# EAGLE design EmcoInterfaceBoard_v4 (EAGLE 8.0.2)
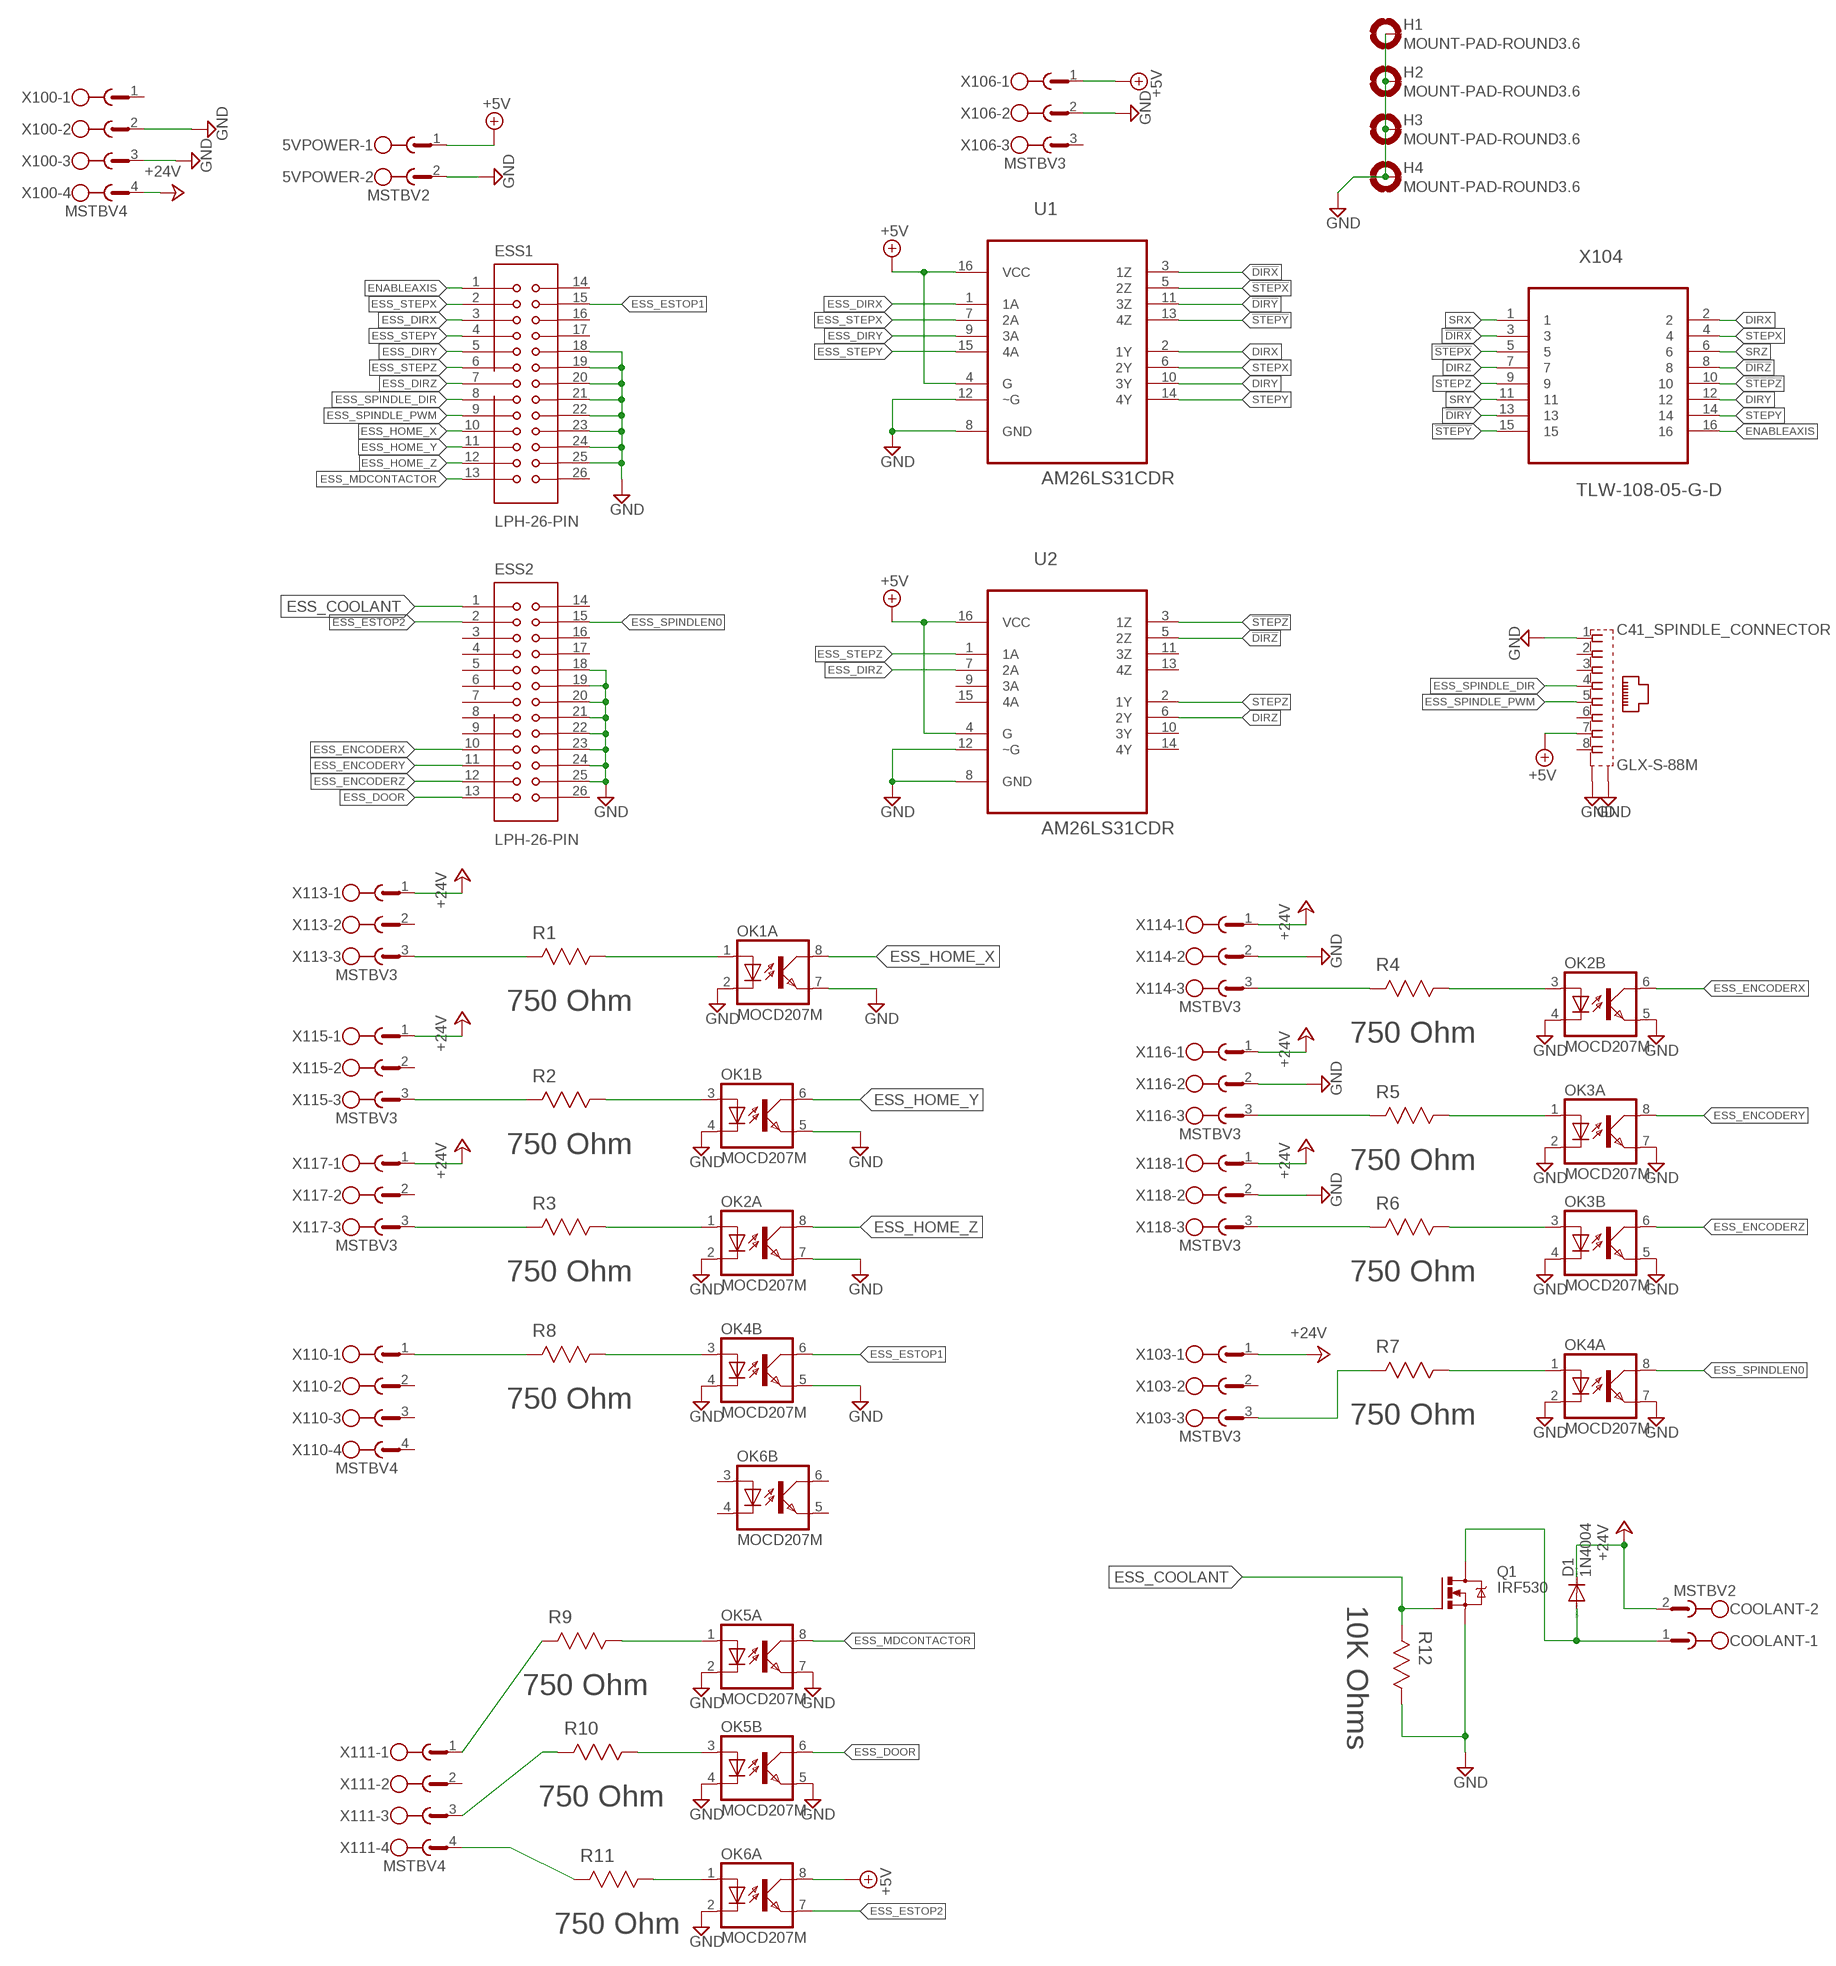
[diagram p0: schematic, sheet 1]

## Parts
5VPOWER  MSTBV2  [MSTBV2]
C41_SPINDLE_CONNECTOR  GLX-S-88M  [GLX-S-88M]
COOLANT  MSTBV2  [MSTBV2]
D1  1N4004  [DO41-10]
ESS1  LPH-26-PIN  [LOWPROFILEHEADER-26PIN]
ESS2  LPH-26-PIN  [LOWPROFILEHEADER-26PIN]
H1  MOUNT-PAD-ROUND3.6  [3,6-PAD]
H2  MOUNT-PAD-ROUND3.6  [3,6-PAD]
H3  MOUNT-PAD-ROUND3.6  [3,6-PAD]
H4  MOUNT-PAD-ROUND3.6  [3,6-PAD]
OK1  MOCD207M  [SOIC08-FAIRCHILD]
OK2  MOCD207M  [SOIC08-FAIRCHILD]
OK3  MOCD207M  [SOIC08-FAIRCHILD]
OK4  MOCD207M  [SOIC08-FAIRCHILD]
OK5  MOCD207M  [SOIC08-FAIRCHILD]
OK6  MOCD207M  [SOIC08-FAIRCHILD]
Q1  IRF530  [TO220BV]
R1  750 Ohm  CRCW2512750RFKEG  [RESC6332X71N]
R2  750 Ohm  CRCW2512750RFKEG  [RESC6332X71N]
R3  750 Ohm  CRCW2512750RFKEG  [RESC6332X71N]
R4  750 Ohm  CRCW2512750RFKEG  [RESC6332X71N]
R5  750 Ohm  CRCW2512750RFKEG  [RESC6332X71N]
R6  750 Ohm  CRCW2512750RFKEG  [RESC6332X71N]
R7  750 Ohm  CRCW2512750RFKEG  [RESC6332X71N]
R8  750 Ohm  CRCW2512750RFKEG  [RESC6332X71N]
R9  750 Ohm  CRCW2512750RFKEG  [RESC6332X71N]
R10  750 Ohm  CRCW2512750RFKEG  [RESC6332X71N]
R11  750 Ohm  CRCW2512750RFKEG  [RESC6332X71N]
R12  10K Ohms  MC0.125W12065%10K  [RESC3216X71N]
U1  AM26LS31CDR  [SOIC127P600X175-16N]
U2  AM26LS31CDR  [SOIC127P600X175-16N]
X100  MSTBV4  [MSTBV4]
X103  MSTBV3  [MSTBV3]
X104  TLW-108-05-G-D  [SAMTEC_TLW-108-05-G-D]
X106  MSTBV3  [MSTBV3]
X110  MSTBV4  [MSTBV4]
X111  MSTBV4  [MSTBV4]
X113  MSTBV3  [MSTBV3]
X114  MSTBV3  [MSTBV3]
X115  MSTBV3  [MSTBV3]
X116  MSTBV3  [MSTBV3]
X117  MSTBV3  [MSTBV3]
X118  MSTBV3  [MSTBV3]

## Nets
!DIRX! [5VSignal]: U1.3(1Z) X104.3
!DIRY! [5VSignal]: U1.11(3Z) X104.13
!DIRZ! [5VSignal]: U2.5(2Z) X104.8
!STEPX! [5VSignal]: U1.5(2Z) X104.5
!STEPY! [5VSignal]: U1.13(4Z) X104.15
!STEPZ! [5VSignal]: U2.3(1Z) X104.10
+5V [Power]: 5VPOWER.1 C41_SPINDLE_CONNECTOR.7 OK6.8(A:COL) U1.4(G) U1.16(VCC) U2.4(G) U2.16(VCC) X106.1
+24V [Power]: COOLANT.2 D1.C X100.4 X103.1 X113.1 X114.1 X115.1 X116.1 X117.1 X118.1
DIRX [5VSignal]: U1.2(1Y) X104.2
DIRY [5VSignal]: U1.10(3Y) X104.12
DIRZ [5VSignal]: U2.6(2Y) X104.7
ENABLEAXIS [5VSignal]: ESS1.1 X104.16
ENCODERX [24VSignal]: R4.2 X114.3
ENCODERY [24VSignal]: R5.2 X116.3
ENCODERZ [24VSignal]: R6.2 X118.3
ESS_COOLANT: ESS2.1 Q1.G R12.2(R2)
ESS_DIRX [5VSignal]: ESS1.3 U1.1(1A)
ESS_DIRY [5VSignal]: ESS1.5 U1.9(3A)
ESS_DIRZ [5VSignal]: ESS1.7 U2.7(2A)
ESS_DOOR: ESS2.13 OK5.6(B:COL)
ESS_ENCODERX: ESS2.10 OK2.6(B:COL)
ESS_ENCODERY: ESS2.11 OK3.8(A:COL)
ESS_ENCODERZ: ESS2.12 OK3.6(B:COL)
ESS_ESTOP1: ESS1.15 OK4.6(B:COL)
ESS_ESTOP2: ESS2.2 OK6.7(A:EMIT)
ESS_HOME_X: ESS1.10 OK1.8(A:COL)
ESS_HOME_Y: ESS1.11 OK1.6(B:COL)
ESS_HOME_Z: ESS1.12 OK2.8(A:COL)
ESS_MDCONTACTOR: ESS1.13 OK5.8(A:COL)
ESS_SPINDLE_DIR [5VSignal]: C41_SPINDLE_CONNECTOR.4 ESS1.8
ESS_SPINDLE_PWM [5VSignal]: C41_SPINDLE_CONNECTOR.5 ESS1.9
ESS_SPINDLEN0: ESS2.15 OK4.8(A:COL)
ESS_STEPX [5VSignal]: ESS1.2 U1.7(2A)
ESS_STEPY [5VSignal]: ESS1.4 U1.15(4A)
ESS_STEPZ [5VSignal]: ESS1.6 U2.1(1A)
GND [GND]: 5VPOWER.2 C41_SPINDLE_CONNECTOR.1 C41_SPINDLE_CONNECTOR.S1 C41_SPINDLE_CONNECTOR.S2 ESS1.18 ESS1.19 ESS1.20 ESS1.21 ESS1.22 ESS1.23 ESS1.24 ESS1.25 ESS2.18 ESS2.19 ESS2.20 ESS2.21 ESS2.22 ESS2.23 ESS2.24 ESS2.25 H1.B3,6(MOUNT) H2.B3,6(MOUNT) H3.B3,6(MOUNT) H4.B3,6(MOUNT) OK1.2(A:C) OK1.4(B:C) OK1.5(B:EMIT) OK1.7(A:EMIT) OK2.2(A:C) OK2.4(B:C) OK2.5(B:EMIT) OK2.7(A:EMIT) OK3.2(A:C) OK3.4(B:C) OK3.5(B:EMIT) OK3.7(A:EMIT) OK4.2(A:C) OK4.4(B:C) OK4.5(B:EMIT) OK4.7(A:EMIT) OK5.2(A:C) OK5.4(B:C) OK5.5(B:EMIT) OK5.7(A:EMIT) OK6.2(A:C) Q1.S R12.1(R1) U1.8(GND) U1.12(~G) U2.8(GND) U2.12(~G) X100.2 X100.3 X106.2 X114.2 X116.2 X118.2
N$1 [24VSignal]: OK3.3(B:A) R6.1
N$3 [24VSignal]: OK3.1(A:A) R5.1
N$7 [24VSignal]: OK2.3(B:A) R4.1
N$8: OK1.3(B:A) R2.1
N$9 [24VSignal]: OK2.1(A:A) R3.1
N$10 [24VSignal]: OK1.1(A:A) R1.1
N$11 [24VSignal]: OK4.1(A:A) R7.1
N$12 [24VSignal]: R1.2 X113.3
N$13 [24VSignal]: R7.2 X103.3
N$14: R2.2 X115.3
N$15 [24VSignal]: R8.2 X110.1
N$16 [24VSignal]: R3.2 X117.3
N$17 [24VSignal]: OK4.3(B:A) R8.1
N$18 [24VSignal]: R9.2 X111.1
N$19 [24VSignal]: OK5.1(A:A) R9.1
N$20 [24VSignal]: OK5.3(B:A) R10.1
N$21 [24VSignal]: R10.2 X111.3
N$22 [24VSignal]: OK6.1(A:A) R11.1
N$23 [24VSignal]: R11.2 X111.4
N$26: COOLANT.1 D1.A Q1.D
SRX: X104.1
SRY: X104.11
SRZ: X104.6
STEPX [5VSignal]: U1.6(2Y) X104.4
STEPY [5VSignal]: U1.14(4Y) X104.14
STEPZ [5VSignal]: U2.2(1Y) X104.9
Unconnected: C41_SPINDLE_CONNECTOR.2 C41_SPINDLE_CONNECTOR.3 C41_SPINDLE_CONNECTOR.6 C41_SPINDLE_CONNECTOR.8 ESS1.14 ESS1.16 ESS1.17 ESS1.26 ESS2.3 ESS2.4 ESS2.5 ESS2.6 ESS2.7 ESS2.8 ESS2.9 ESS2.14 ESS2.16 ESS2.17 ESS2.26 OK6.3(B:A) OK6.4(B:C) OK6.5(B:EMIT) OK6.6(B:COL) U2.9(3A) U2.10(3Y) U2.11(3Z) U2.13(4Z) U2.14(4Y) U2.15(4A) X100.1 X103.2 X106.3 X110.2 X110.3 X110.4 X111.2 X113.2 X115.2 X117.2

## Library data of the parts
5VPOWER COOLANT = con-phoenix-508:MSTBV2: PHOENIX; MF: WEIDMULLER, INC.; MPN: 1521860000; OC_FARNELL: 1792792; OC_NEWARK: 36K7716
C41_SPINDLE_CONNECTOR = con-kycon:GLX-S-88M: Mod. Jack, Right Angle, 8 posiotion, 8 contatcs RJ45 Source: GLX-S-88M.pdf; MF: MOLEX; MPN: 43860-0025; OC_FARNELL: unknown; OC_NEWARK: 57H0755
D1 = diode:1N4004: DIODE general purpose rectifier, 1 A; MPN: 1N4007.; OC_NEWARK: 98K5005
ESS1 ESS2 = ESS_Rev0:LPH-26-PIN; MF: TYCO ELECTRONICS; MPN: 5103308-6; OC_NEWARK: 73K6771
H1-H4 = ESS_Rev0:MOUNT-PAD-ROUND: MOUNTING PAD, round; OC_NEWARK: unknown
OK1-OK6 = optocoupler:MOCD20*M: MOCD207M, MOCD208M Dual Channel Phototransistor Small Outline Surface Mount Optocouplers Source: Data sheet <http://www.fairchildsemi.com/ds/MO%2FMOCD207-M.pdf>; MF: FAIRCHILD SEMICONDUCTOR; MPN: MOCD207M; OC_FARNELL: 1623297; OC_NEWARK: 67K0803
Q1 = transistor-power:IRF530: HEXFET Power MOSFET; MF: FAIRCHILD SEMICONDUCTOR; MPN: FQP30N06L; OC_NEWARK: 20C4477
R1-R11 = Vishay_By_element14_Batch_1:CRCW2512750RFKEG: RESISTOR, 2512; MF: VISHAY/DALE; MPN: CRCW2512750RFKEG; OC_FARNELL: 1703769; OC_NEWARK: 53K3986; SUPPLIER: Vishay; TOLERANCE: ±1%; WATTAGE: 1 W
R12 = Multicomp_By_element14_Batch_1:MC0.125W12065%10K: RESISTOR, 1206; MPN: RC1206FR-0710KL; OC_FARNELL: 9337016; OC_NEWARK: 68R0292; SUPPLIER: Multicomp; TOLERANCE: ±5%; WATTAGE: 1/8 W
U1 U2 = Texas Instruments_By_element14_Batch_1:AM26LS31CDR: QUADRUPLE DIFFERENTIAL LINE DRIVER; MF: TEXAS INSTRUMENTS; MPN: AM26LS31CDR; OC_FARNELL: -; OC_NEWARK: 34K0704; PACKAGE: SOIC-16; SUPPLIER: TEXAS INSTRUMENTS
X100 X110 X111 = con-phoenix-508:MSTBV4: PHOENIX; MF: WEIDMULLER, INC.; MPN: 1522060000; OC_FARNELL: 1792794; OC_NEWARK: 35K5121
X103 X106 X113-X118 = con-phoenix-508:MSTBV3: PHOENIX; MF: WEIDMULLER, INC.; MPN: 1521960000; OC_FARNELL: 1792793; OC_NEWARK: 84F418
X104 = SAMTEC-Txx_By_element14_Batch_1:TLW-108-05-G-D: LOW PROFILE HEADER, DOUBLE ROW, 16 way; MF: TYCO ELECTRONICS; MPN: 2-1761603-6; OC_FARNELL: 1668501; OC_NEWARK: 06M6904; PACKAGE: LOW PROFILE HEADER; SUPPLIER: SAMTEC

## Net classes
0 default: width 0.381 mm
1 GND: width 0.635 mm
2 Power: width 0.508 mm
3 24VSignal: width 0.508 mm
4 5VSignal: width 0.508 mm

## Board
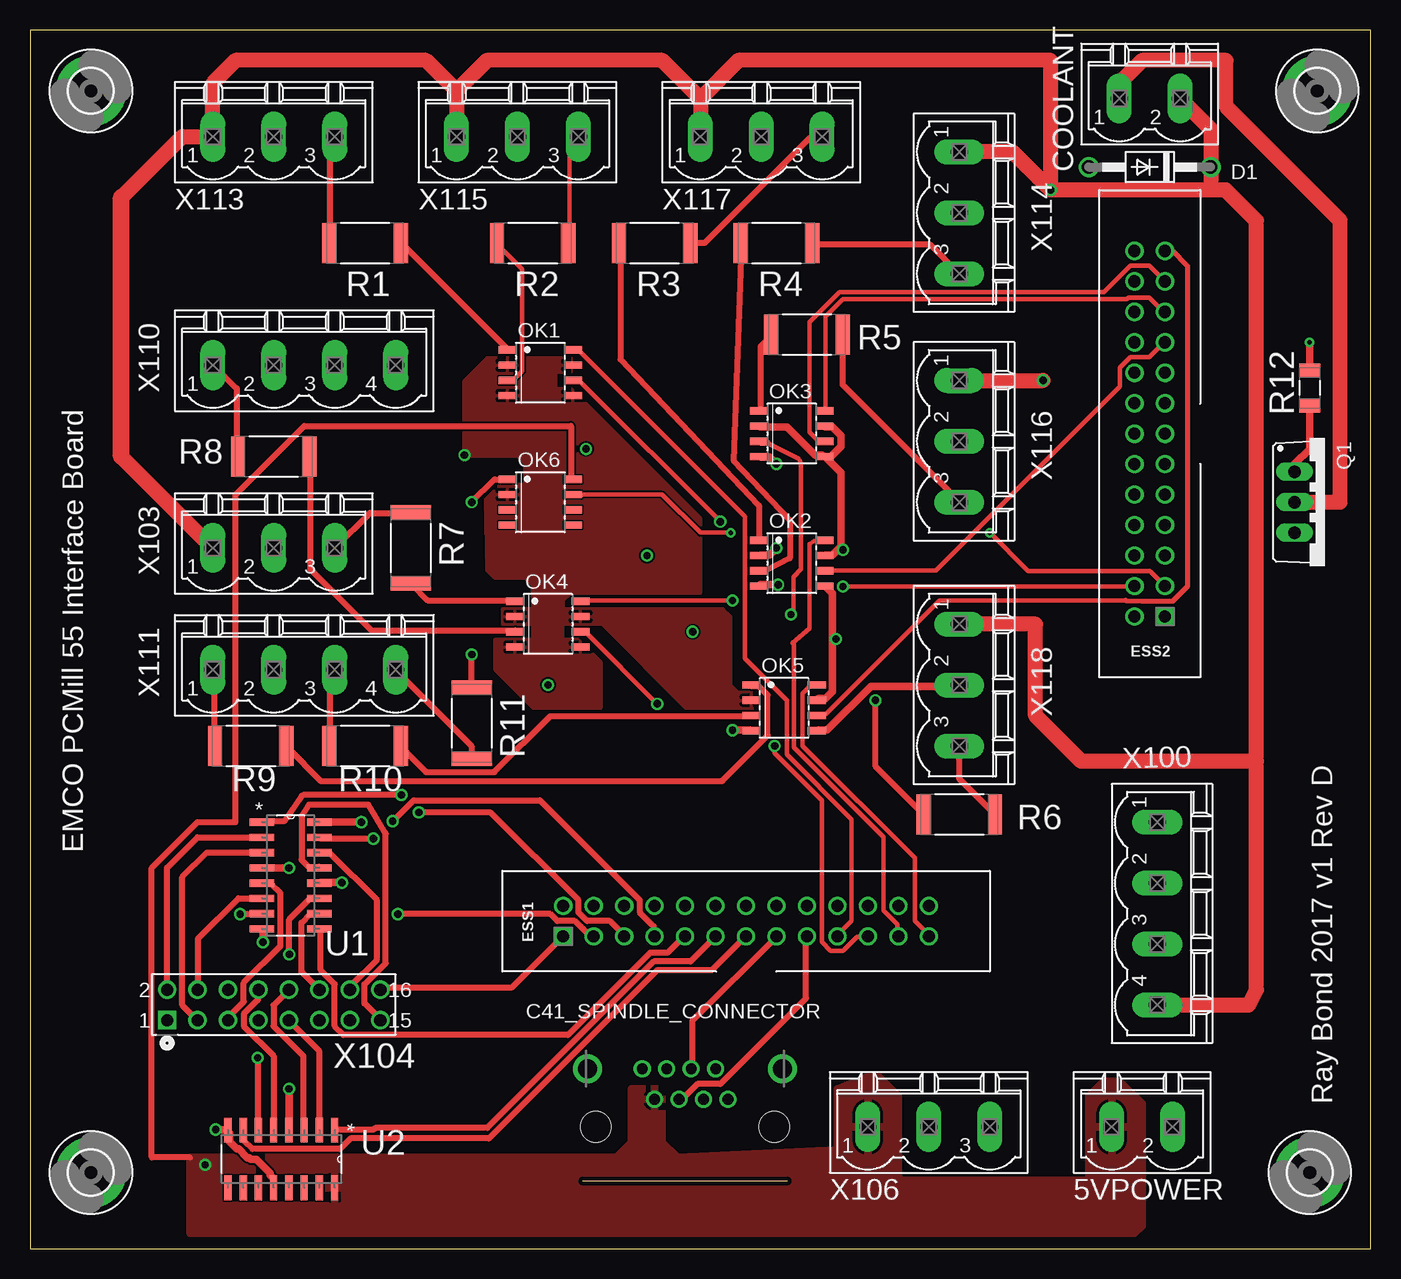
[diagram p1: board, top side]
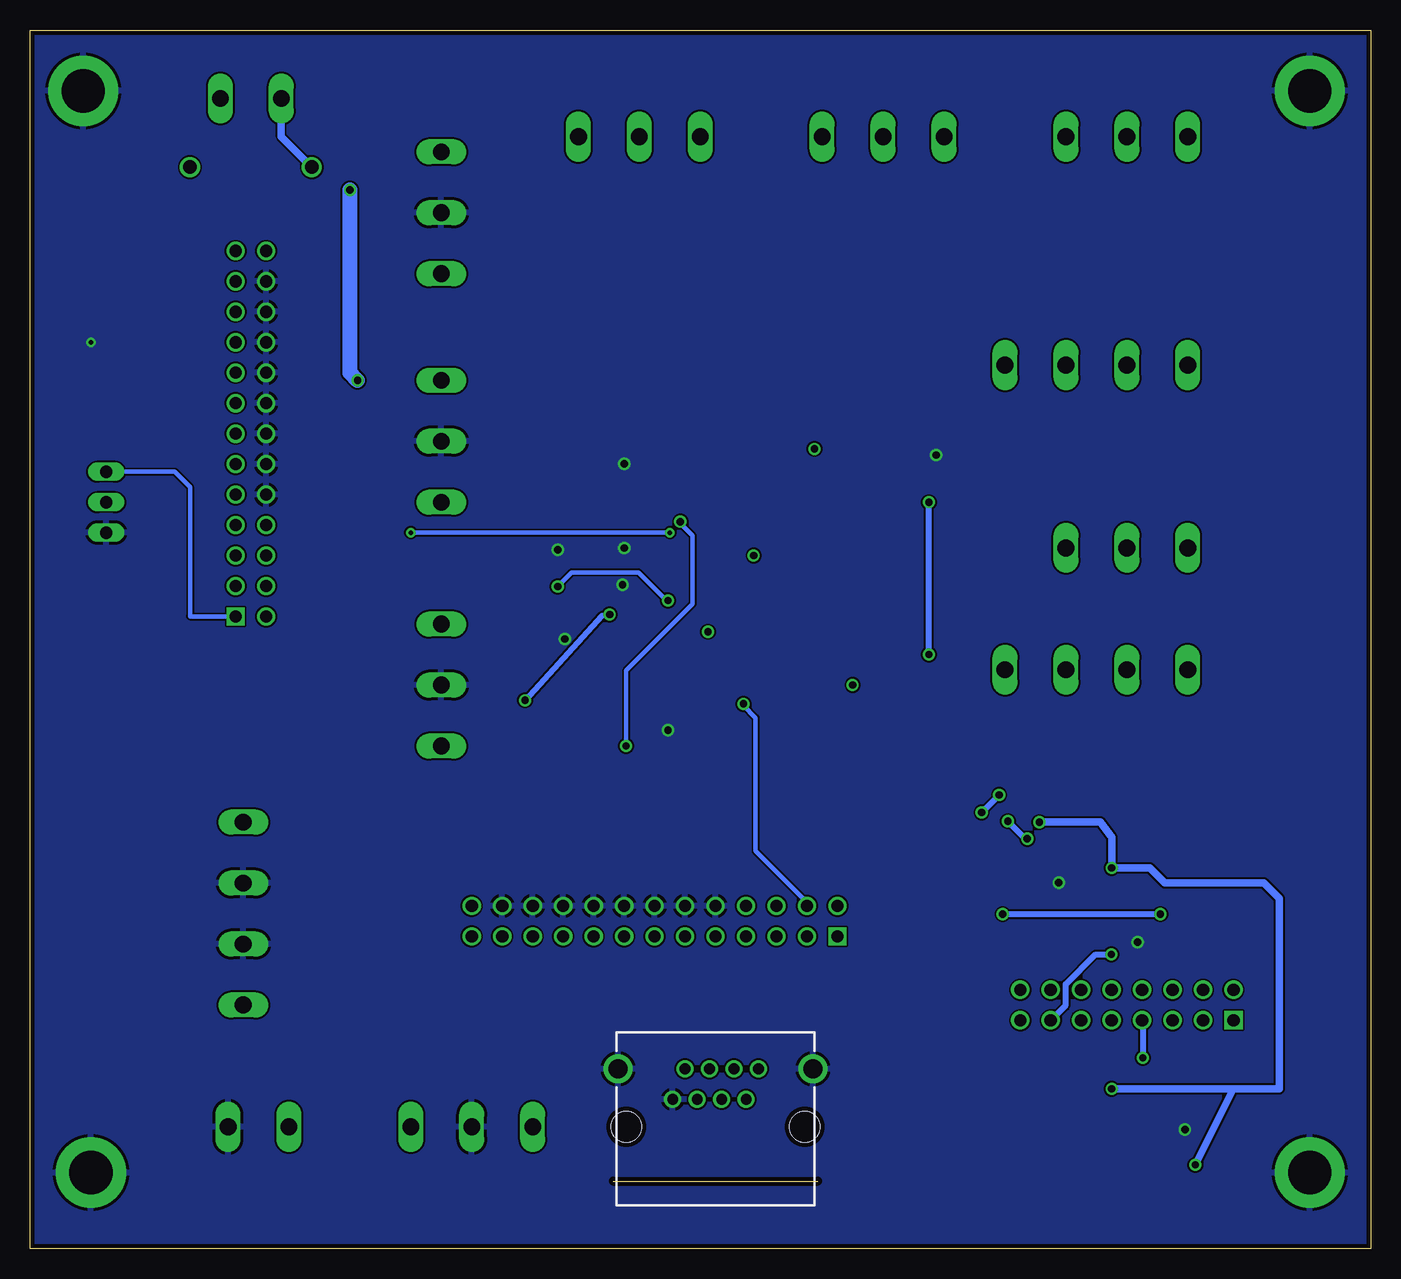
[diagram p2: board, bottom side, seen from below]

Size 111.76 x 101.6 mm. Coordinates in mm from the lower left corner, seen from the top.
Outline: 0,0 111.76,0 111.76,101.6 0,101.6 0,0
Copper layers (1*16): Top 0.035559375mm / dielectric 1.501140625mm / Bottom 0.035559375mm
Design rules "typical_4pcb": minimum track width 10mil, minimum drill 15mil, track to track 6mil, track to pad 6mil, pad to pad 6mil, via to via 6mil, smd to smd 6mil, copper to edge 15mil, drill to drill 8mil, minimum pad ring 10mil, minimum via ring 8mil, stop-mask expansion 4mil, vias tented up to drill 0mil, thermal gap 10mil

### Footprints (pad centres in the part's own frame; a part is rotated, then mirrored left to right if it is on the bottom)
MSTBV2 = drill 1.397 long: 1 -2.54,0; 2 2.54,0
GLX-S-88M = drill 0.9 pad 1.422: 1 -3.57,-2.3; 2 -2.55,-4.84; 3 -1.53,-2.3; 4 -0.51,-4.84; 5 0.51,-2.3; 6 1.53,-4.84; 7 2.55,-2.3; 8 3.57,-4.84 | drill 1.6 pad 2.184: S1 -8.125,-4.84; S2 8.125,-4.84 | hole 2.55: -7.44,0; 7.44,0
DO41-10 = drill 1.118: A 5.08,0; C -5.08,0
LOWPROFILEHEADER-26PIN = drill 1.016 square: 1 -1.27,15.24 | drill 1.016: 2 -1.27,12.7; 3 -1.27,10.16; 4 -1.27,7.62; 5 -1.27,5.08; 6 -1.27,2.54; 7 -1.27,0; 8 -1.27,-2.54; 9 -1.27,-5.08; 10 -1.27,-7.62; 11 -1.27,-10.16; 12 -1.27,-12.7; 13 -1.27,-15.24; 14 1.27,15.24; 15 1.27,12.7; 16 1.27,10.16; 17 1.27,7.62; 18 1.27,5.08; 19 1.27,2.54; 20 1.27,0; 21 1.27,-2.54; 22 1.27,-5.08; 23 1.27,-7.62; 24 1.27,-10.16; 25 1.27,-12.7; 26 1.27,-15.24
3,6-PAD = drill 3.6 pad 5.842: B3,6 0,0
SOIC08-FAIRCHILD = smd 0.61 x 1.52: 1 -1.905,-2.723; 2 -0.635,-2.723; 3 0.635,-2.723; 4 1.905,-2.723; 5 1.905,2.723; 6 0.635,2.723; 7 -0.635,2.723; 8 -1.905,2.723
TO220BV = drill 1.016 long: D 0,-2.54; G -2.54,-2.54; S 2.54,-2.54
RESC6332X71N = smd 1.194 x 3.353: 1 -2.972,0; 2 2.972,0
RESC3216X71N = smd 1.118 x 1.753: 1 -1.473,0; 2 1.473,0
SOIC127P600X175-16N = smd 2.057 x 0.61: 1 -4.801,8.89; 2 -4.801,7.62; 3 -4.801,6.35; 4 -4.801,5.08; 5 -4.801,3.81; 6 -4.801,2.54; 7 -4.801,1.27; 8 -4.801,0; 9 0,0; 10 0,1.27; 11 0,2.54; 12 0,3.81; 13 0,5.08; 14 0,6.35; 15 0,7.62; 16 0,8.89
MSTBV4 = drill 1.397 long: 1 -7.62,0; 2 -2.54,0; 3 2.54,0; 4 7.62,0
MSTBV3 = drill 1.397 long: 1 -5.08,0; 2 0,0; 3 5.08,0
SAMTEC_TLW-108-05-G-D = drill 1.016 square: 1 -17.78,-2.54 | drill 1.016: 2 -17.78,0; 3 -15.24,-2.54; 4 -15.24,0; 5 -12.7,-2.54; 6 -12.7,0; 7 -10.16,-2.54; 8 -10.16,0; 9 -7.62,-2.54; 10 -7.62,0; 11 -5.08,-2.54; 12 -5.08,0; 13 -2.54,-2.54; 14 -2.54,0; 15 0,-2.54; 16 0,0

### Placement (x,y rotation side)
5VPOWER  92.71,10.16 0 top
C41_SPINDLE_CONNECTOR  54.61,10.16 180 top
COOLANT  93.34,95.89 0 top
D1  93.34,90.17 180 top
ESS1  59.69,27.3 90 top
ESS2  93.34,67.94 180 top
H1  5.08,6.35 180 top
H2  5.08,96.52 0 top
H3  107.31,96.52 0 top
H4  106.68,6.35 0 top
OK1  42.55,73.03 270 top
OK2  63.5,57.15 270 top
OK3  63.5,67.94 270 top
OK4  43.18,52.07 270 top
OK5  62.87,45.09 270 top
OK6  42.55,62.23 270 top
Q1  107.95,62.23 270 top
R1  27.94,83.82 180 top
R2  41.91,83.82 0 top
R3  52.07,83.82 0 top
R4  62.23,83.82 0 top
R5  64.77,76.2 0 top
R6  77.47,36.2 0 top
R7  31.75,58.42 90 top
R8  20.32,66.04 180 top
R9  18.41,41.91 180 top
R10  27.94,41.91 180 top
R11  36.83,43.81 270 top
R12  106.68,71.75 270 top
U1  24.13,26.67 0 top
U2  16.51,5.08 270 top
X100  93.98,27.94 270 top
X103  20.32,58.42 0 top
X104  29.21,21.59 0 top
X106  74.93,10.16 0 top
X110  22.86,73.66 0 top
X111  22.86,48.26 0 top
X113  20.32,92.71 0 top
X114  77.47,86.36 270 top
X115  40.64,92.71 0 top
X116  77.47,67.31 270 top
X117  60.96,92.71 0 top
X118  77.47,46.99 270 top

### Tracks (layer width: path | path; a pad name or v marks a point on that pad's centre or on a via)
!DIRX!
  Top 0.508: 18.55,33.01 19.28,33.01 U1.3 14.75,33.02 12.71,30.98 12.71,20.3 13.88,19.13 X104.3
!DIRY!  (via drill 0.61)
  Top 0.508: U1.11 23.37,29.21 21.61,27.46 v21.61,24.54
  Bottom 0.508: v21.61,24.54 22.93,24.54 25.41,22.05 25.41,20.3 26.58,19.13 X104.13
!DIRZ!
  Top 0.508: U2.5 20.3,9.93 20.3,16.07 17.82,18.55 17.82,19.57 18.99,20.74 18.99,21.47 X104.8
!STEPX!
  Top 0.508: U1.5 19.43,30.38 20.16,30.38 20.89,29.65 20.89,25.27 17.82,22.2 17.82,20.59 16.65,19.43 16.65,19.13 X104.5
!STEPY!
  Top 0.508: U1.13 24.1,31.84 23.22,31.84 22.64,32.42 22.64,36.07 23.25,37 28.21,37 29.65,34.61 29.65,23.81 27.9,22.05 27.9,20.45 29.21,19.13 X104.15
!STEPZ!
  Top 0.508: X104.10 20.3,20.3 20.3,18.55 22.78,16.07 22.78,9.93 U2.3
+5V  (via drill 0.6)
  Top 0.508: 13.34,7.62 10.16,7.62 10.16,31.75 13.97,35.56 17.14,35.56 17.14,62.87 22.86,68.58 45.09,68.58 45.09,64.14 OK6.8
  Top 0.635: U1.4 v21.59,31.75 | v27.62,35.56 U1.16 | U2.4 v21.59,13.34
  Bottom 0.635: v27.62,35.56 22.54,35.56 21.59,34.29 v21.59,31.75 18.41,31.75 17.14,30.48 8.89,30.48 7.62,29.21 7.62,13.34 11.43,13.34 | v14.61,6.99 11.43,13.34 | v21.59,13.34 11.43,13.34
  pour Top: 13.34,7.62 48.9,7.62 50.16,8.89 50.16,13.34 52.7,13.34 52.7,8.89 53.98,7.62 67.31,8.26 67.31,13.34 70.48,14.61 72.39,12.7 72.39,5.71 88.27,5.71 88.27,12.7 89.53,13.97 90.81,13.97 92.71,12.06 92.71,1.91 92.08,1.27 13.34,1.27
+24V  (via drill 0.6)
  Top 1.27: X100.4 101.6,20.32 102.23,21.59 102.23,40.64 | 102.23,40.64 87.63,40.64 83.82,44.45 83.82,52.07 X118.1 | 102.23,40.64 102.23,85.72 99.69,88.27 98.42,88.27 | 98.42,88.27 v85.09,88.27 | v85.09,88.27 81.92,91.44 X114.1 | X116.1 v84.45,72.39 | v85.09,88.27 85.09,99.06 59.05,99.06 55.88,95.89 | 55.88,95.89 X117.1 | 55.88,95.89 52.7,99.06 38.1,99.06 35.56,96.52 | 35.56,96.52 X115.1 | 35.56,96.52 33.02,99.06 17.14,99.06 15.24,97.16 X113.1 12.7,92.71 7.62,87.63 | X103.1 7.62,66.04 | 98.42,88.27 D1.C 98.42,93.34 COOLANT.2
  Top 1.422: 7.62,66.04 7.62,87.63
  Bottom 1.27: v84.45,72.39 85.09,73.03 v85.09,88.27
DIRX
  Top 0.508: X104.2 11.43,31.75 13.97,34.29 U1.2
DIRY
  Top 0.508: U1.10 24.1,27.9 23.37,27.9 22.64,27.16 22.64,23.08 24.1,21.61 X104.12
DIRZ  (via drill 0.61)
  Top 0.508: v18.99,15.92 18.99,9.93 U2.6
  Bottom 0.508: v18.99,15.92 18.99,18.99 X104.7
ENABLEAXIS
  Top 0.508: 29.21,21.61 X104.16 29.36,21.76 40.16,21.76 44.4,26 ESS1.1
ENCODERX
  Top 0.508: R4.2 65.28,83.69 75.07,83.69 77.41,81.35 X114.3
ENCODERY
  Top 0.508: R5.2 67.77,76.09 67.77,72 77.41,62.36 X116.3
ENCODERZ
  Top 0.508: 77.55,41.77 X118.3 77.47,39.17 R6.2
ESS_COOLANT
  Top 0.61: R12.2 106.68,66.67 105.41,65.41 Q1.G
  Bottom 0.381: ESS2.1 98.42,52.7 98.42,63.5 99.69,64.77 Q1.G
ESS_DIRX  (via drill 0.61)
  Top 0.508: U1.1 19.43,35.64 21.18,35.64 22.64,37.73 22.78,37.83 v30.96,37.83 | v32.42,36.37 38.41,36.37 45.71,29.06 45.71,28.04 46.44,27.31 48.34,27.31 49.51,26.14 ESS1.3
  Bottom 0.508: v32.42,36.37 v30.96,37.83
ESS_DIRY
  Top 0.508: U1.9 24.24,26.58 24.24,23.22 25.41,22.05 25.41,18.55 26.14,17.82 44.84,17.82 51.7,24.68 53.16,24.68 54.48,26 ESS1.5
ESS_DIRZ
  Top 0.508: U2.7 17.82,9.79 17.82,9.05 18.55,8.32 25.85,8.32 26.73,9.2 38.27,9.2 52.29,23.22 56.81,23.22 59.59,26 ESS1.7
ESS_DOOR
  Top 0.381: 91.33,54.04 75.8,54.04 66.31,44.55 65.72,44.55 OK5.6 | ESS2.13 94.64,83.1
  Top 0.406: 91.33,54.04 92.66,53.98 95.25,53.98 96.52,55.24 96.52,81.92 95.25,83.19 ESS2.13
ESS_ENCODERX
  Top 0.381: OK2.6 66.31,56.52 75.51,56.52 90.84,71.86 90.84,73.46 91.72,74.34 93.33,74.34 94.49,75.51 ESS2.10
ESS_ENCODERY
  Top 0.381: 66.31,69.96 OK3.8 66.31,70.1 66.31,77.7 67.77,79.16 91.43,79.16 91.57,79.31 93.33,79.31 94.49,78.14 ESS2.11
ESS_ENCODERZ
  Top 0.381: ESS2.12 93.33,81.93 91.72,81.93 89.53,79.74 67.47,79.74 64.99,77.26 64.99,68.06 65.72,67.33 66.16,67.33 OK3.6
ESS_ESTOP1  (via drill 0.61)
  Top 0.381: v52.29,45.42 46.3,51.41 46.01,51.41 OK4.6
  Bottom 0.381: v52.29,45.42 52.29,45.28 51.26,44.25 51.26,33.15 47.03,28.92 47.03,28.63 ESS1.15
ESS_ESTOP2  (via drill 0.38)
  Top 0.381: OK6.7 52.7,62.87 55.88,59.69 v58.42,59.69 | v80.01,59.69 83.19,56.52 93.34,56.52 ESS2.2
  Bottom 0.381: v80.01,59.69 v58.42,59.69
ESS_HOME_X
  Top 0.381: OK1.8 45.71,74.92 59.59,61.05 59.59,49.22 63.09,45.71 63.09,41.19 68.5,35.78 68.5,27.31 67.33,26.14 ESS1.10
ESS_HOME_Y  (via drill 0.61)
  Top 0.381: v57.54,60.61 45.86,72.3 45.28,72.3 OK1.6 | v62.07,41.92 62.07,41.33 66.02,37.39 66.02,25.56 66.75,24.83 67.77,24.83 68.94,26 69.81,26 ESS1.11
  Bottom 0.381: v62.07,41.92 62.07,48.2 56.52,53.75 56.52,59.44 57.54,60.47 v57.54,60.61
ESS_HOME_Z
  Top 0.381: OK2.8 66.16,59 65.35,59 64.96,58.74 64.96,51.7 63.58,50.51 | 63.57,50.5 63.58,50.51 | ESS1.12 72.3,26.14 72.3,27.02 71.13,28.19 71.13,34.32 63.68,41.77 63.68,50.39 63.58,50.51
ESS_MDCONTACTOR
  Top 0.381: OK5.8 65.58,46.88 64.99,46.88 64.41,46.3 64.41,41.92 73.75,32.57 73.75,27.31 74.92,26.14 ESS1.13
ESS_SPINDLE_DIR
  Top 0.508: C41_SPINDLE_CONNECTOR.4 55.21,15.04 55.21,18.99 62.22,26 ESS1.8
ESS_SPINDLE_PWM
  Top 0.508: C41_SPINDLE_CONNECTOR.5 54.19,12.56 54.48,12.56 55.65,13.73 57.54,13.73 64.7,20.89 64.7,26 ESS1.9
ESS_SPINDLEN0  (via drill 0.61)
  Top 0.381: v58.57,54.04 46.01,54.04 OK4.8 | v67.77,55.21 92.01,55.21 ESS2.15
  Bottom 0.381: v67.77,55.21 66.6,56.38 61.05,56.38 58.71,54.04 v58.57,54.04
ESS_STEPX  (via drill 0.61)
  Top 0.508: v17.53,27.9 19.28,27.9 U1.7 | v30.67,27.9 43.38,27.9 43.96,27.31 45.42,27.31 46.59,26.14 46.88,26.14 ESS1.2
  Bottom 0.508: v30.67,27.9 v17.53,27.9
ESS_STEPY  (via drill 0.61)
  Top 0.508: v28.63,34.18 24.24,34.18 U1.15 | v30.23,35.64 31.98,37.39 42.5,37.39 50.83,29.06 50.83,28.04 51.99,26.87 51.99,26.14 ESS1.4
  Bottom 0.508: v30.23,35.64 28.77,34.18 v28.63,34.18
ESS_STEPZ
  Top 0.508: U2.1 25.41,9.93 28.63,9.93 28.77,10.08 38.12,10.08 51.99,23.95 55.06,23.95 57.11,26 ESS1.6
GND  (via drill 0.38, 0.61)
  Top 0.61: R12.1 v106.68,75.56
  Top 0.635: 67.55,58.49 67.62,58.57 67.62,64.7 66.31,66.02 OK3.5 | 67.55,58.49 66.89,57.84 66.31,57.84 OK2.7 | OK3.2 60.9,68.5 63.09,68.5 65.43,66.16 66.02,66.16 OK3.5 | OK3.7 66.31,68.5 66.89,68.5 67.62,67.77 67.62,66.89 66.75,66.02 OK3.5 | 66.89,50.83 66.89,54.62 66.31,55.21 OK2.5 | 66.89,50.83 66.89,46.44 66.31,45.86 65.72,45.86 OK5.7 | v58.57,43.23 60.03,43.23 OK5.4 | OK5.5 65.72,43.23 66.45,43.23 70.1,46.88 77.41,46.88 X118.2 | v62.36,55.35 60.9,55.35 OK2.4 | v62.22,58.42 61.63,57.84 60.9,57.84 OK2.2 | v62.22,65.43 61.63,66.02 60.9,66.02 OK3.4 | v15.48,9.93 16.5,9.93 U2.8 16.65,9.64 16.65,8.91 17.23,8.32 17.38,8.32 18.11,7.59 18.26,7.59 18.4,7.45 18.84,7.45 20.01,6.28 20.01,6.13 20.3,5.84 20.3,5.11 U2.12 | v19.43,25.56 19.43,26.58 U1.8 | v26,30.52 24.24,30.52 U1.12 | v67.18,50.83 66.89,50.83 | v67.77,58.27 67.55,58.49
  other vias: 36.22,66.16
  pour Bottom: 0,101.6 111.76,101.6 111.76,0 0,0
  pour Top: 38.73,50.8 38.73,48.26 41.91,45.09 47.62,45.09 47.62,48.9 45.72,50.8 44.45,50.8 44.45,52.07 47.62,52.07 54.61,45.09 60.33,45.09 60.33,46.35 59.05,46.35 58.42,46.99 58.42,52.7 57.78,53.34 39.37,53.34 39.37,52.07 41.91,52.07 41.91,50.8
  pour Top: 41.91,53.34 41.91,55.24 41.27,55.88 38.73,55.88 38.1,56.52 37.97,62.48 39.24,63.75 41.27,63.75 41.27,65.41 40.64,66.04 36.2,66.04 36.2,72.39 38.1,74.3 45.09,74.3 45.09,73.03 43.81,73.03 43.81,71.75 45.09,71.75 55.88,60.96 55.88,54.61 45.09,54.61 44.45,53.98 44.45,53.34
N$1  (via drill 0.6, 0.61)
  Top 0.381: 61.49,67.18 64.07,65.87 64.2,65.72 64.26,65.28 64.26,56.64 63.63,56.01 63.63,53.06 v63.44,52.87
  Top 0.508: 61.49,67.18 60.9,67.18 OK3.3 | R6.1 70.48,40.21 v70.48,45.72
  Bottom 0.508: v70.48,45.72 64.07,52.77 v63.44,52.87
N$2  (via drill 0.6)
  other vias: 51.44,57.78
N$3
  Top 0.508: OK3.1 60.9,69.96 60.9,75.22 61.78,76.09 R5.1
N$4  (via drill 0.6)
  other vias: 46.35,66.67
N$5  (via drill 0.6)
  other vias: 43.18,46.99
N$6  (via drill 0.6)
  other vias: 55.24,51.44
N$7
  Top 0.508: OK2.3 60.9,56.52 61.34,56.52 63.34,57.57 63.34,60.73 58.66,65.72 59.3,83.69 R4.1
N$8
  Top 0.381: OK1.3 39.87,72.44 40.31,72.44 41.04,73.17 41.04,81.64 38.99,83.69 R2.1
N$9
  Top 0.508: OK2.1 60.76,59.15 60.76,61.97 49.22,74.14 49.22,83.69 R3.1
N$10
  Top 0.508: OK1.1 39.73,75.07 30.96,83.83 R1.1
N$11
  Top 0.508: OK4.1 40.46,54.04 33.15,54.04 31.84,55.35 R7.1
N$12
  Top 0.508: R1.2 24.98,83.83 24.98,92.3 25.27,92.6 X113.3
N$13
  Top 0.508: R7.2 31.69,61.34 28.33,61.34 25.41,58.42 X103.3
N$14
  Top 0.381: R2.2 44.98,83.83 44.98,91.86 45.71,92.6 X115.3
N$15
  Top 0.508: R8.2 17.23,66.16 17.23,71.71 15.34,73.61 X110.1
N$16
  Top 0.508: R3.2 55.06,83.83 56.23,83.83 64.99,92.6 66.02,92.6 X117.3
N$17
  Top 0.508: OK4.3 40.46,51.56 28.48,51.56 23.37,56.67 23.37,66.02 R8.1
N$18
  Top 0.508: R9.2 15.34,41.92 15.34,48.2 X111.1
N$19
  Top 0.508: OK5.1 60.17,46.88 60.76,46.88 61.49,46.15 61.49,42.79 57.69,38.99 24.24,38.99 21.47,41.77 R9.1
N$20
  Top 0.508: OK5.3 60.03,44.4 43.38,44.4 38.7,39.73 33.01,39.73 30.96,41.77 R10.1
N$21
  Top 0.508: R10.2 24.98,47.9 25.27,48.2 X111.3
N$22  (via drill 0.6)
  Top 0.508: 40.31,64.12 39.87,64.12 OK6.1 38.73,64.14 v36.83,62.23 | 36.95,46.88 R11.1 v36.83,49.53
  Bottom 0.508: v36.83,49.53 v36.83,62.23
N$23
  Top 0.508: R11.2 36.8,40.89 36.8,41.92 30.52,48.2 X111.4
N$26
  Top 1.27: Q1.D 109.22,62.23 109.22,85.72 99.69,95.25 99.69,99.06 92.71,99.06 90.81,97.16 COOLANT.1
  Bottom 0.61: D1.A 90.81,92.71 COOLANT.1
STEPX
  Top 0.508: U1.6 17.38,29.21 14.02,25.85 14.02,21.61 X104.4
STEPY
  Top 0.508: U1.14 24.24,33.01 24.98,33.01 28.92,29.06 28.92,24.1 26.73,21.91 26.73,21.61 X104.14
STEPZ
  Top 0.508: U2.2 24.1,9.93 24.1,16.5 21.61,18.99 X104.9

### Text on the board
tNames: EMCO PCMill 55 Interface Board | Ray Bond 2017 v1 Rev D